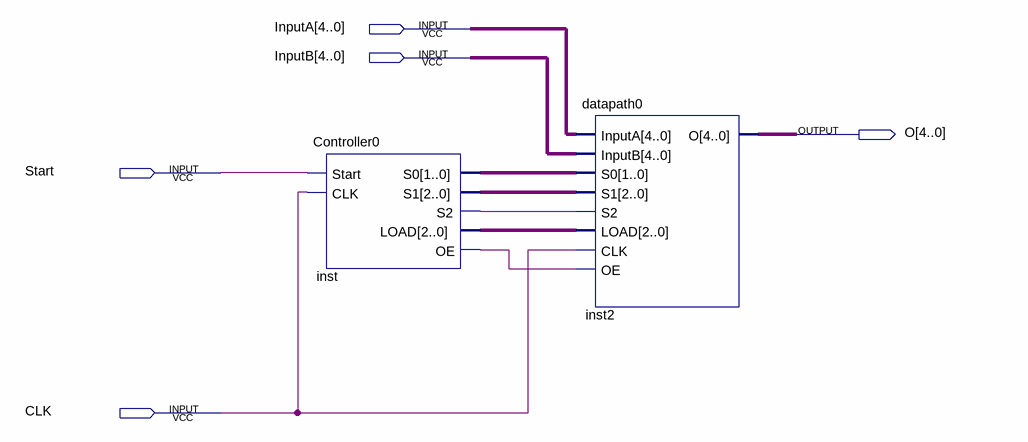
[diagram p0: schematic sheet]
// Quartus schematic RSLE.bdf as structural Verilog: 2 symbols, 5 pins
module RSLE (
  input  [4:0] InputA,
  input  [4:0] InputB,
  input  Start,
  input  CLK,
  output [4:0] O
);

  wire inst_oe, inst_s2;
  wire [1:0] inst_s0;
  wire [2:0] inst_load, inst_s1;

  Controller0 inst (.Start(Start), .CLK(CLK), .S0(inst_s0), .S1(inst_s1), .S2(inst_s2), .LOAD(inst_load), .OE(inst_oe));
  datapath0 inst2 (
    .InputA(InputA), .InputB(InputB), .S0(inst_s0), .S1(inst_s1), .S2(inst_s2), .LOAD(inst_load), .CLK(CLK),
    .OE(inst_oe), .O(O));
endmodule
